# EAGLE design ZORRO-LAN-IDE-CP-V2 (EAGLE 6.6.0)

## Sheet 1 of 3
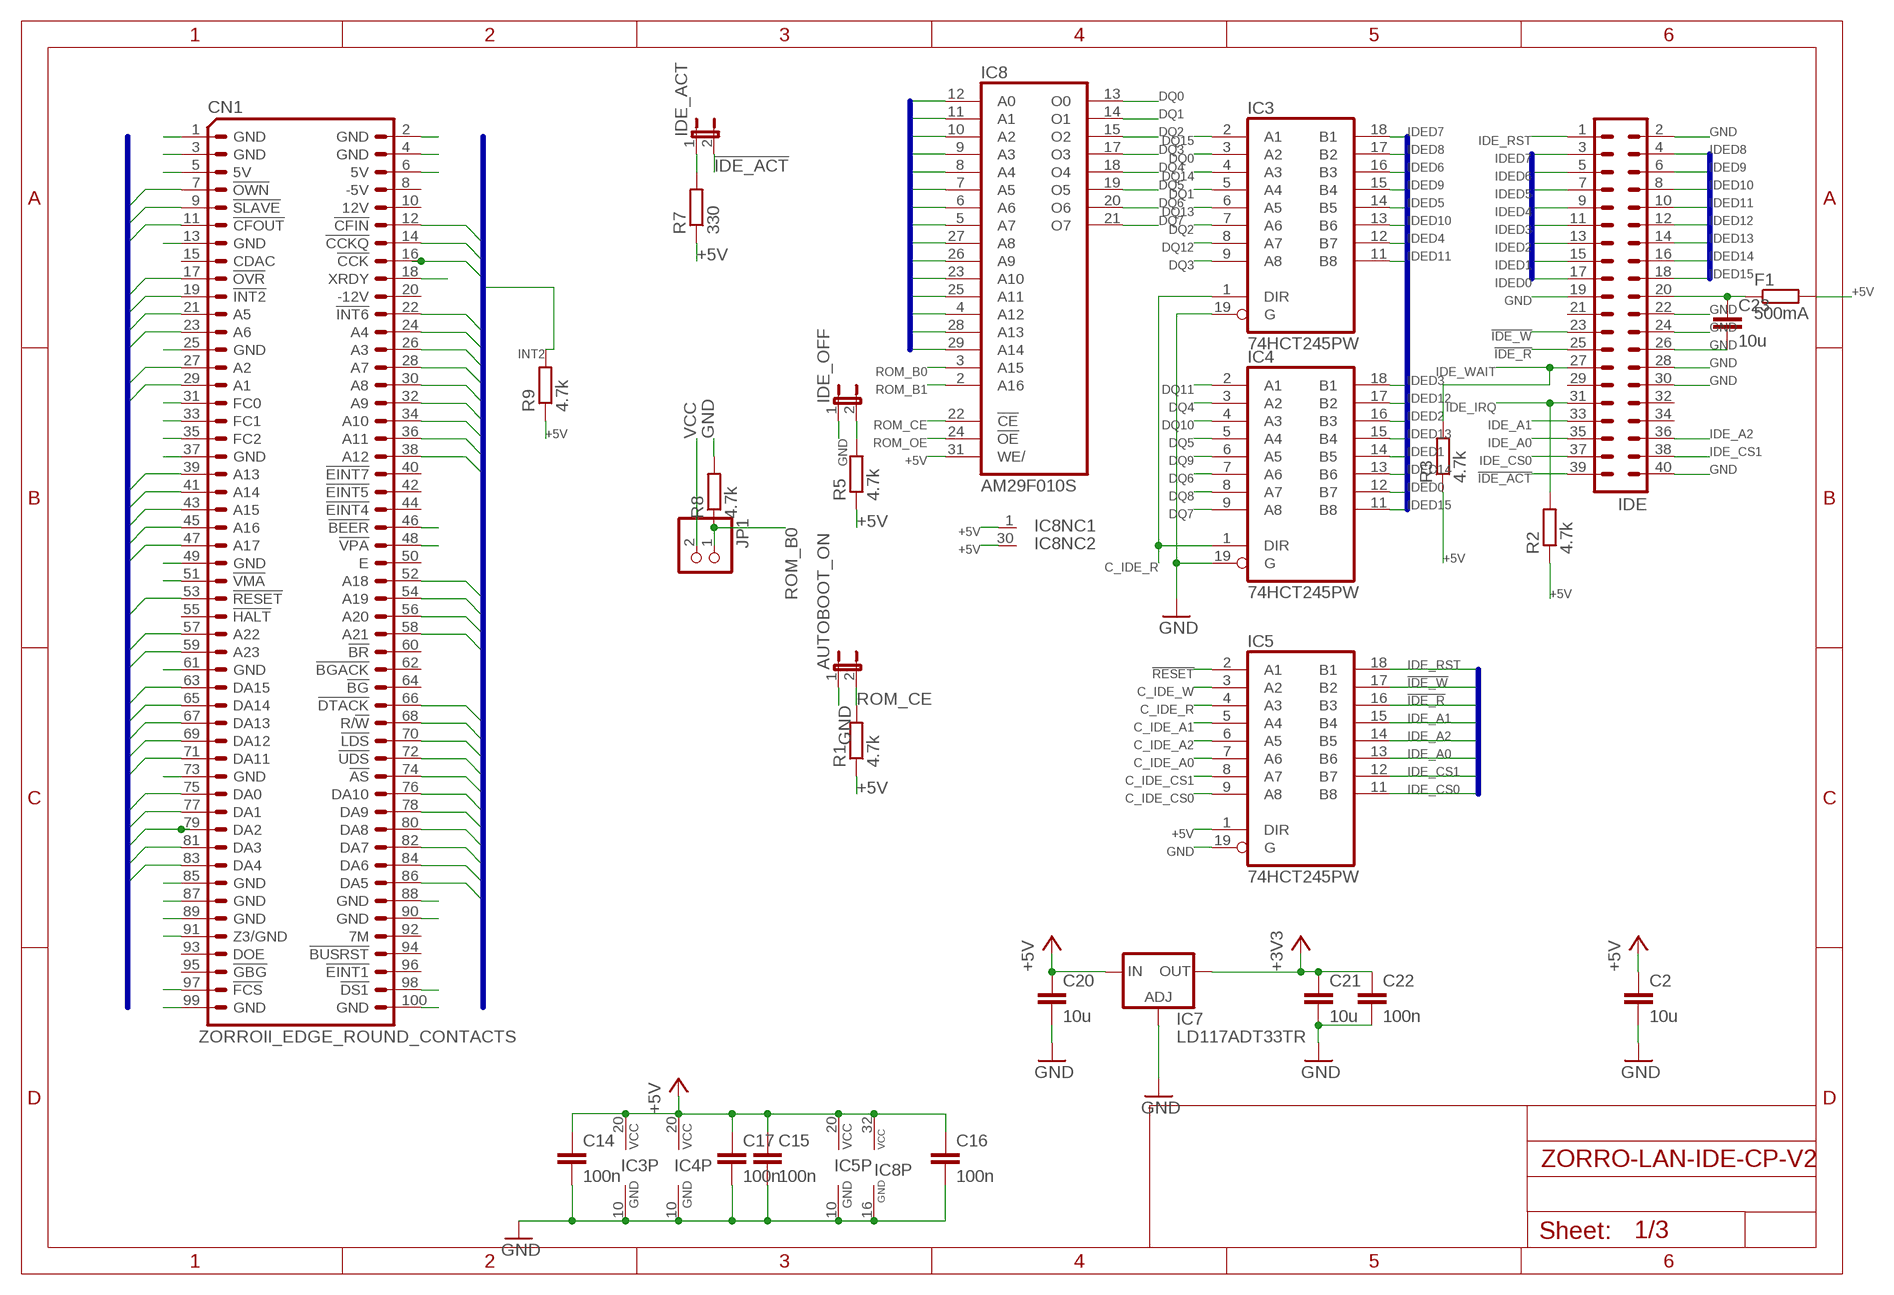
[diagram p0: schematic, sheet 1]

### Parts
AUTOBOOT_ON  JP1E  [JP1]
C2  10u  C-EUC0805K  [C0805K]
C14  100n  C-EUC0603K  [C0603K]
C15  100n  C-EUC0603K  [C0603K]
C16  100n  C-EUC0603K  [C0603K]
C17  100n  C-EUC0603K  [C0603K]
C20  10u  C-EUC1210K  [C1210K]
C21  10u  C-EUC1210K  [C1210K]
C22  100n  C-EUC0603K  [C0603K]
C23  10u  C-EUC0805K  [C0805K]
CN1  ZORROII_EDGE_ROUND_CONTACTS  [LKONT_50_R]
F1  500mA  R-EU_R2512  [R2512]
IC3  74HCT245PW  [TSSOP20]
IC4  74HCT245PW  [TSSOP20]
IC5  74HCT245PW  [TSSOP20]
IC7  LD117ADT33TR  [DPACK]
IC8  AM29F010S  [PLCC-SR32]
IDE  ML40  [ML40]
IDE_ACT  JP1E  [JP1]
IDE_OFF  JP1E  [JP1]
JP1  PINHD-1X02_2.54-S  [1X02-S]
R1  4.7k  R-EU_R0603  [R0603]
R2  4.7k  R-EU_R0603  [R0603]
R3  4.7k  R-EU_R0603  [R0603]
R5  4.7k  R-EU_R0603  [R0603]
R7  330  R-EU_R0603  [R0603]
R8  4.7k  R-EU_R0603  [R0603]
R9  4.7k  R-EU_R0603  [R0603]

### Nets
!AS: CN1.74(!AS!) ; also sheet 2
!BERR: CN1.46(!BEER!) ; also sheet 2
!CFIN: CN1.12(!CFIN!) ; also sheet 2
!CFOUT: CN1.11(!CFOUT!) ; also sheet 2
!DS0: CN1.51(!VMA!) ; also sheet 2
!DS1: CN1.98(!DS1!) ; also sheet 2
!DTACK: CN1.66(!DTACK!) ; also sheet 2
!FCS: CN1.97(!FCS!) ; also sheet 2
!IDE_ACT: IDE.39 IDE_ACT.2
!IDE_R: IC5.16(B3) IDE.25
!IDE_W: IC5.17(B2) IDE.23
!LDS: CN1.70(!LDS!) ; also sheet 2
!MTACK: CN1.48(!VPA!) ; also sheet 2
!MTCR: CN1.18(XRDY) ; also sheet 2
!OVR: CN1.17(!OVR!) ; also sheet 2
!OWN: CN1.7(!OWN!) ; also sheet 2
!RESET: CN1.53(!RESET!) IC5.2(A1) ; also sheet 2
!SLAVE: CN1.9(!SLAVE!) ; also sheet 2
!UDS: CN1.72(!UDS!) ; also sheet 2
+3V3: C21.1 C22.1 IC7.4(OUT) ; also sheet 2,3
+5V: C2.1 C14.1 C15.1 C16.1 C17.1 C20.1 CN1.5(5V) CN1.6(5V) F1.2 IC3.20(VCC) IC4.20(VCC) IC5.1(DIR) IC5.20(VCC) IC7.3(IN) IC8.1(NC) IC8.30(NC) IC8.31(WE/) IC8.32(VCC) R1.1 R2.1 R3.1 R5.1 R7.1 R9.1 ; also sheet 2,3
A1: CN1.29(A1) IC8.12(A0) ; also sheet 2
A2: CN1.27(A2) IC8.11(A1) ; also sheet 2
A3: CN1.26(A3) IC8.10(A2) ; also sheet 2
A4: CN1.24(A4) IC8.9(A3) ; also sheet 2
A5: CN1.21(A5) IC8.8(A4) ; also sheet 2
A6: CN1.23(A6) IC8.7(A5) ; also sheet 2
A7: CN1.28(A7) IC8.6(A6) ; also sheet 2
A8: CN1.30(A8) IC8.5(A7) ; also sheet 2
A9: CN1.32(A9) IC8.27(A8) ; also sheet 2
A10: CN1.34(A10) IC8.26(A9) ; also sheet 2
A11: CN1.36(A11) IC8.23(A10) ; also sheet 2
A12: CN1.38(A12) IC8.25(A11) ; also sheet 2
A13: CN1.39(A13) IC8.4(A12) ; also sheet 2
A14: CN1.41(A14) IC8.28(A13) ; also sheet 2
A15: CN1.43(A15) IC8.29(A14) ; also sheet 2
A16: CN1.45(A16) ; also sheet 2
A17: CN1.47(A17) ; also sheet 2
A18: CN1.52(A18) ; also sheet 2
A19: CN1.54(A19) ; also sheet 2
A20: CN1.56(A20) ; also sheet 2
A21: CN1.58(A21) ; also sheet 2
A22: CN1.57(A22) ; also sheet 2
A23: CN1.59(A23) ; also sheet 2
AUTO_BOOT_OFF: IDE_OFF.2 R5.2 ; also sheet 2
C1: CN1.14(!CCKQ!) ; also sheet 2
C3: CN1.16(!CCK!) ; also sheet 2
C_IDE_A0: IC5.7(A6) ; also sheet 2
C_IDE_A1: IC5.5(A4) ; also sheet 2
C_IDE_A2: IC5.6(A5) ; also sheet 2
C_IDE_CS0: IC5.9(A8) ; also sheet 2
C_IDE_CS1: IC5.8(A7) ; also sheet 2
C_IDE_R: IC3.1(DIR) IC4.1(DIR) IC5.4(A3) ; also sheet 2
C_IDE_W: IC5.3(A2) ; also sheet 2
D0: CN1.75(DA0) ; also sheet 2
D1: CN1.77(DA1) ; also sheet 2
D2: CN1.79(DA2) ; also sheet 2
D3: CN1.81(DA3) ; also sheet 2
D4: CN1.83(DA4) ; also sheet 2
D5: CN1.86(DA5) ; also sheet 2
D6: CN1.84(DA6) ; also sheet 2
D7: CN1.82(DA7) ; also sheet 2
D8: CN1.80(DA8) ; also sheet 2
D9: CN1.78(DA9) ; also sheet 2
D10: CN1.76(DA10) ; also sheet 2
D11: CN1.71(DA11) ; also sheet 2
D12: CN1.69(DA12) ; also sheet 2
D13: CN1.67(DA13) ; also sheet 2
D14: CN1.65(DA14) ; also sheet 2
D15: CN1.63(DA15) ; also sheet 2
DQ0: IC3.3(A2) IC8.13(O0) ; also sheet 2,3
DQ1: IC3.5(A4) IC8.14(O1) ; also sheet 2,3
DQ2: IC3.7(A6) IC8.15(O2) ; also sheet 2,3
DQ3: IC3.9(A8) IC8.17(O3) ; also sheet 2,3
DQ4: IC4.3(A2) IC8.18(O4) ; also sheet 2,3
DQ5: IC4.5(A4) IC8.19(O5) ; also sheet 2,3
DQ6: IC4.7(A6) IC8.20(O6) ; also sheet 2,3
DQ7: IC4.9(A8) IC8.21(O7) ; also sheet 2,3
DQ8: IC4.8(A7) ; also sheet 2,3
DQ9: IC4.6(A5) ; also sheet 2,3
DQ10: IC4.4(A3) ; also sheet 2,3
DQ11: IC4.2(A1) ; also sheet 2,3
DQ12: IC3.8(A7) ; also sheet 2,3
DQ13: IC3.6(A5) ; also sheet 2,3
DQ14: IC3.4(A3) ; also sheet 2,3
DQ15: IC3.2(A1) ; also sheet 2,3
FC0: CN1.31(FC0)
FC1: CN1.33(FC1)
FC2: CN1.35(FC2)
GND: AUTOBOOT_ON.1 C2.2 C14.2 C15.2 C16.2 C17.2 C20.2 C21.2 C22.2 C23.2 CN1.1(GND) CN1.2(GND) CN1.3(GND) CN1.4(GND) CN1.13(GND) CN1.25(GND) CN1.37(GND) CN1.49(GND) CN1.61(GND) CN1.73(GND) CN1.85(GND) CN1.87(GND) CN1.88(GND) CN1.89(GND) CN1.90(GND) CN1.99(GND) CN1.100(GND) IC3.10(GND) IC3.19(G) IC4.10(GND) IC4.19(G) IC5.10(GND) IC5.19(G) IC7.1(ADJ) IC8.16(GND) IDE.2 IDE.19 IDE.22 IDE.24 IDE.26 IDE.28 IDE.30 IDE.40 IDE_OFF.1 R8.2 ; also sheet 2,3
IDE_A0: IC5.13(B6) IDE.35
IDE_A1: IC5.15(B4) IDE.33
IDE_A2: IC5.14(B5) IDE.36
IDE_CS0: IC5.11(B8) IDE.37
IDE_CS1: IC5.12(B7) IDE.38
IDE_IRQ: IDE.31 R2.2
IDE_RST: IC5.18(B1) IDE.1 ; also sheet 3
IDE_WAIT: IDE.27 R3.2 ; also sheet 2
IDED0: IC4.12(B7) IDE.17
IDED1: IC4.14(B5) IDE.15
IDED2: IC4.16(B3) IDE.13
IDED3: IC4.18(B1) IDE.11
IDED4: IC3.12(B7) IDE.9
IDED5: IC3.14(B5) IDE.7
IDED6: IC3.16(B3) IDE.5
IDED7: IC3.18(B1) IDE.3
IDED8: IC3.17(B2) IDE.4
IDED9: IC3.15(B4) IDE.6
IDED10: IC3.13(B6) IDE.8
IDED11: IC3.11(B8) IDE.10
IDED12: IC4.17(B2) IDE.12
IDED13: IC4.15(B4) IDE.14
IDED14: IC4.13(B6) IDE.16
IDED15: IC4.11(B8) IDE.18
INT2: CN1.19(!INT2!) R9.2 ; also sheet 2
INT6: CN1.22(!INT6!)
KEY_PIN_POWER: C23.1 F1.1 IDE.20
N$42: IDE_ACT.1 R7.2
R/W: CN1.68(R/!W!) ; also sheet 2
ROM_B0: IC8.3(A15) JP1.1 R8.1 ; also sheet 2
ROM_B1: IC8.2(A16) ; also sheet 2
ROM_CE: AUTOBOOT_ON.2 IC8.22(!CE) R1.2
ROM_OE: IC8.24(!OE) ; also sheet 2
VCC: JP1.2
Z3: CN1.91(Z3/GND) ; also sheet 2
Unconnected: CN1.8(-5V) CN1.10(12V) CN1.15(CDAC) CN1.20(-12V) CN1.40(!EINT7!) CN1.42(!EINT5!) CN1.44(!EINT4!) CN1.50(E) CN1.55(!HALT!) CN1.60(!BR!) CN1.62(!BGACK!) CN1.64(!BG!) CN1.92(7M) CN1.93(DOE) CN1.94(!BUSRST!) CN1.95(!GBG!) CN1.96(!EINT1!) IDE.21 IDE.29 IDE.32 IDE.34

### Buses
IDED[0..15]
IDE_RST,IDE_A[0..2],IDE_CS[0..1],!IDE_R,!IDE_W
A[1..23]
A[1..31],D[0..15],C1,C3,!UDS,!LDS,!RESET,!AS,!DTACK,R/W,!OWN,!SLAVE,!CFIN,!CFOUT,!OVR,INT2,INT6
A[1..23],D[0..15],C1,C3,!UDS,!LDS,!RESET,!AS,!DTACK,R/W,!OWN,!SLAVE,!CFIN,!CFOUT,!OVR,INT2,INT6

## Sheet 2 of 3
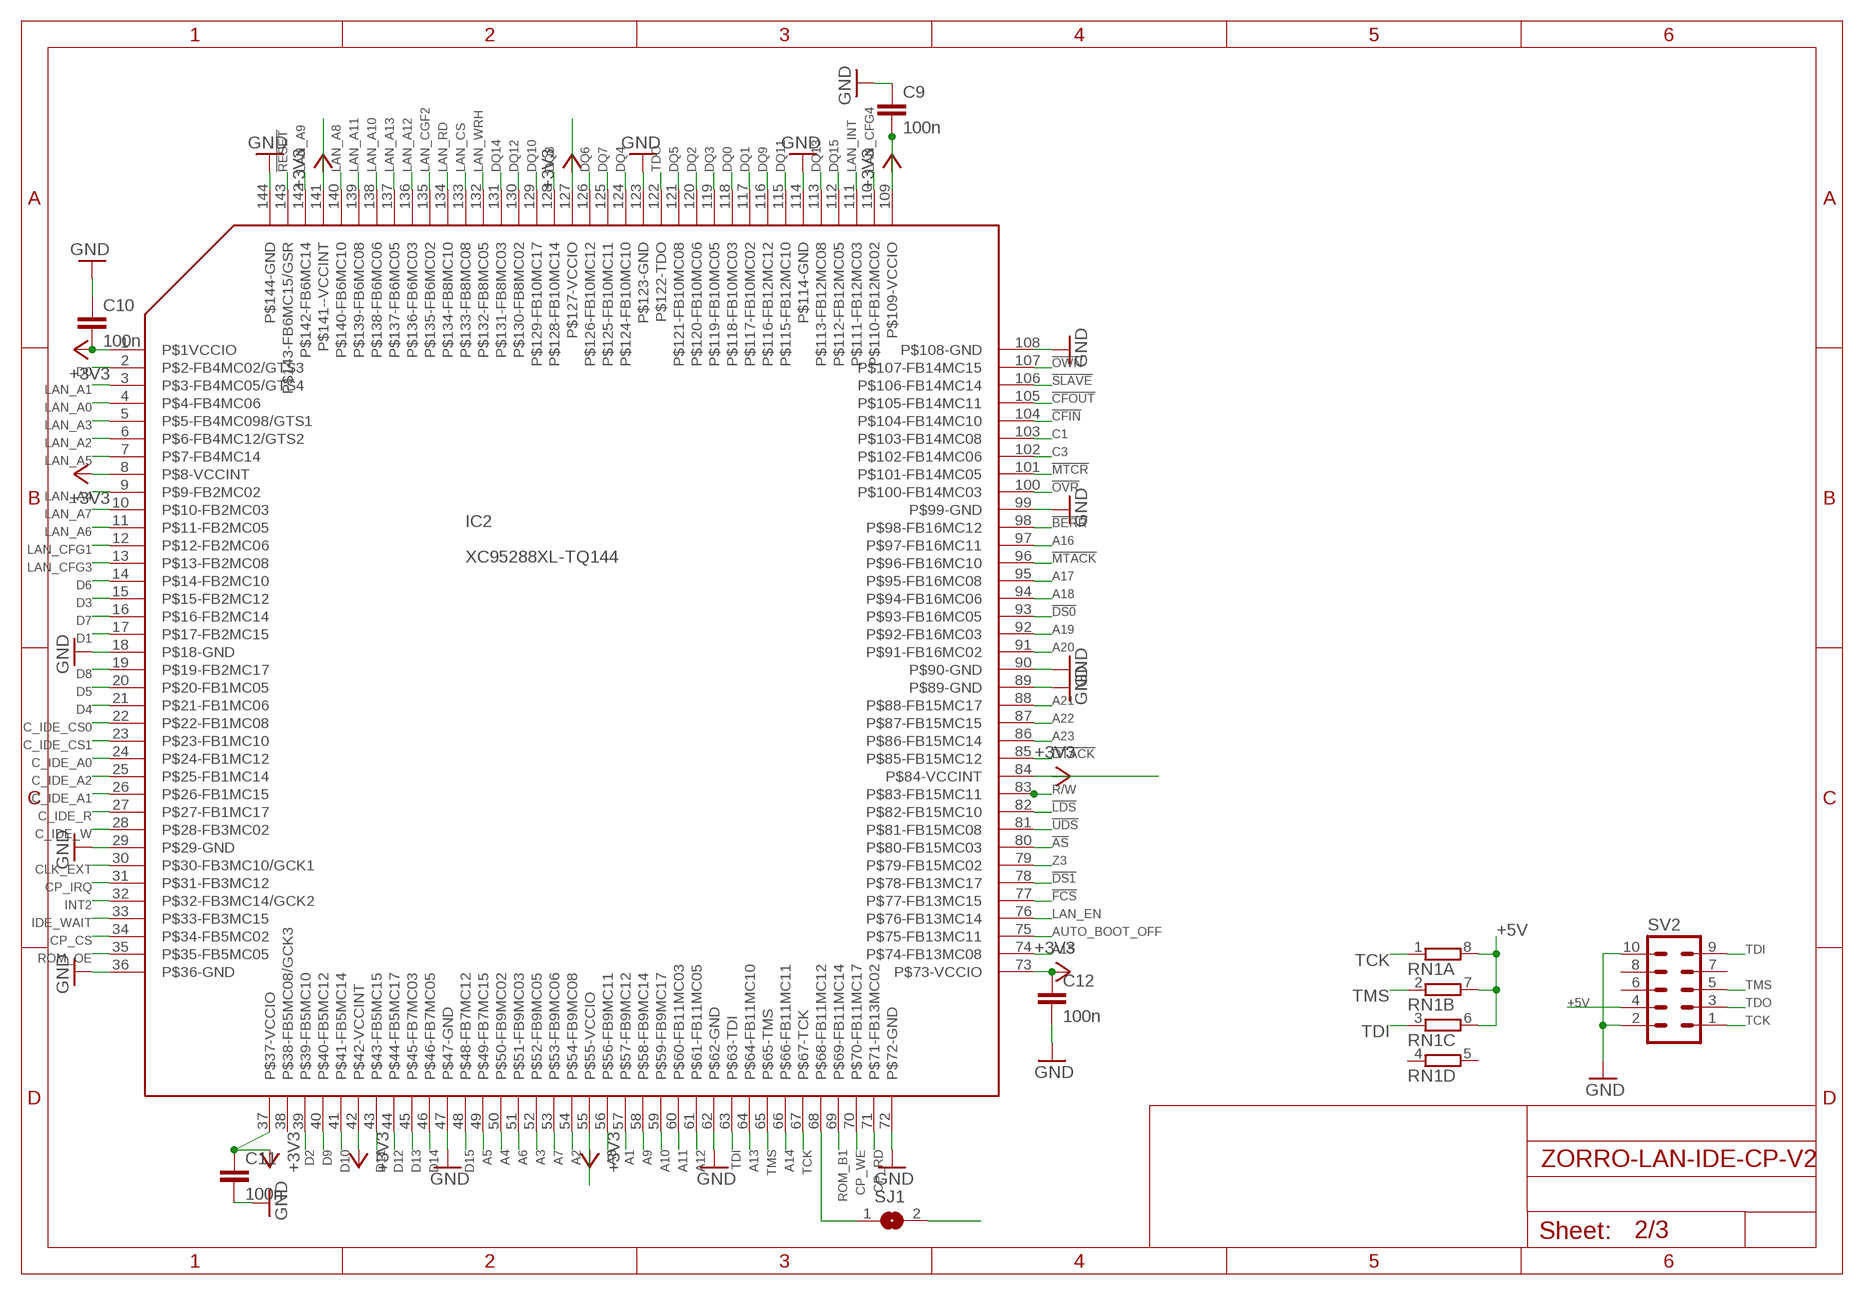
[diagram p1: schematic, sheet 2]

### Parts
C9  100n  C-EUC0603K  [C0603K]
C10  100n  C-EUC0603K  [C0603K]
C11  100n  C-EUC0603K  [C0603K]
C12  100n  C-EUC0603K  [C0603K]
IC2  XC95288XL-TQ144  [TQFP144]
RN1  4R-NCAY16  [CAY16]
SJ1  SJ  [SJ]
SV2  ML10L  [ML10L]

### Nets
!AS: IC2.80(P$80-FB15MC03) ; also sheet 1
!BERR: IC2.98(P$98-FB16MC12) ; also sheet 1
!CFIN: IC2.104(P$104-FB14MC10) ; also sheet 1
!CFOUT: IC2.105(P$105-FB14MC11) ; also sheet 1
!DS0: IC2.93(P$93-FB16MC05) ; also sheet 1
!DS1: IC2.78(P$78-FB13MC17) ; also sheet 1
!DTACK: IC2.85(P$85-FB15MC12) ; also sheet 1
!FCS: IC2.77(P$77-FB13MC15) ; also sheet 1
!LDS: IC2.82(P$82-FB15MC10) ; also sheet 1
!MTACK: IC2.96(P$96-FB16MC10) ; also sheet 1
!MTCR: IC2.101(P$101-FB14MC05) ; also sheet 1
!OVR: IC2.100(P$100-FB14MC03) ; also sheet 1
!OWN: IC2.107(P$107-FB14MC15) ; also sheet 1
!RESET: IC2.143(P$143-FB6MC15/GSR) ; also sheet 1
!SLAVE: IC2.106(P$106-FB14MC14) ; also sheet 1
!UDS: IC2.81(P$81-FB15MC08) ; also sheet 1
+3V3: C9.2 C10.2 C11.1 C12.1 IC2.1(P$1VCCIO) IC2.8(P$8-VCCINT) IC2.37(P$37-VCCIO) IC2.42(P$42-VCCINT) IC2.55(P$55-VCCIO) IC2.73(P$73-VCCIO) IC2.84(P$84-VCCINT) IC2.109(P$109-VCCIO) IC2.127(P$127-VCCIO) IC2.141(P$141--VCCINT) ; also sheet 1,3
+5V: RN1.6 RN1.7 RN1.8 SV2.4 ; also sheet 1,3
A1: IC2.57(P$57-FB9MC12) ; also sheet 1
A2: IC2.54(P$54-FB9MC08) ; also sheet 1
A3: IC2.52(P$52-FB9MC05) ; also sheet 1
A4: IC2.50(P$50-FB9MC02) ; also sheet 1
A5: IC2.49(P$49-FB7MC15) ; also sheet 1
A6: IC2.51(P$51-FB9MC03) ; also sheet 1
A7: IC2.53(P$53-FB9MC06) ; also sheet 1
A8: IC2.56(P$56-FB9MC11) ; also sheet 1
A9: IC2.58(P$58-FB9MC14) ; also sheet 1
A10: IC2.59(P$59-FB9MC17) ; also sheet 1
A11: IC2.60(P$60-FB11MC03) ; also sheet 1
A12: IC2.61(P$61-FB11MC05) ; also sheet 1
A13: IC2.64(P$64-FB11MC10) ; also sheet 1
A14: IC2.66(P$66-FB11MC11) ; also sheet 1
A15: IC2.74(P$74-FB13MC08) ; also sheet 1
A16: IC2.97(P$97-FB16MC11) ; also sheet 1
A17: IC2.95(P$95-FB16MC08) ; also sheet 1
A18: IC2.94(P$94-FB16MC06) ; also sheet 1
A19: IC2.92(P$92-FB16MC03) ; also sheet 1
A20: IC2.91(P$91-FB16MC02) ; also sheet 1
A21: IC2.88(P$88-FB15MC17) ; also sheet 1
A22: IC2.87(P$87-FB15MC15) ; also sheet 1
A23: IC2.86(P$86-FB15MC14) ; also sheet 1
AUTO_BOOT_OFF: IC2.75(P$75-FB13MC11) ; also sheet 1
C1: IC2.103(P$103-FB14MC08) ; also sheet 1
C3: IC2.102(P$102-FB14MC06) ; also sheet 1
C_IDE_A0: IC2.24(P$24-FB1MC12) ; also sheet 1
C_IDE_A1: IC2.26(P$26-FB1MC15) ; also sheet 1
C_IDE_A2: IC2.25(P$25-FB1MC14) ; also sheet 1
C_IDE_CS0: IC2.22(P$22-FB1MC08) ; also sheet 1
C_IDE_CS1: IC2.23(P$23-FB1MC10) ; also sheet 1
C_IDE_R: IC2.27(P$27-FB1MC17) ; also sheet 1
C_IDE_W: IC2.28(P$28-FB3MC02) ; also sheet 1
CLK_EXT: IC2.30(P$30-FB3MC10/GCK1) ; also sheet 3
CP_CS: IC2.34(P$34-FB5MC02) ; also sheet 3
CP_IRQ: IC2.31(P$31-FB3MC12) ; also sheet 3
CP_RD: IC2.71(P$71-FB13MC02) ; also sheet 3
CP_WE: IC2.70(P$70-FB11MC17) ; also sheet 3
D0: IC2.2(P$2-FB4MC02/GTS3) ; also sheet 1
D1: IC2.17(P$17-FB2MC15) ; also sheet 1
D2: IC2.39(P$39-FB5MC10) ; also sheet 1
D3: IC2.15(P$15-FB2MC12) ; also sheet 1
D4: IC2.21(P$21-FB1MC06) ; also sheet 1
D5: IC2.20(P$20-FB1MC05) ; also sheet 1
D6: IC2.14(P$14-FB2MC10) ; also sheet 1
D7: IC2.16(P$16-FB2MC14) ; also sheet 1
D8: IC2.19(P$19-FB2MC17) ; also sheet 1
D9: IC2.40(P$40-FB5MC12) ; also sheet 1
D10: IC2.41(P$41-FB5MC14) ; also sheet 1
D11: IC2.43(P$43-FB5MC15) ; also sheet 1
D12: IC2.44(P$44-FB5MC17) ; also sheet 1
D13: IC2.45(P$45-FB7MC03) ; also sheet 1
D14: IC2.46(P$46-FB7MC05) ; also sheet 1
D15: IC2.48(P$48-FB7MC12) ; also sheet 1
DQ0: IC2.118(P$118-FB10MC03) ; also sheet 1,3
DQ1: IC2.117(P$117-FB10MC02) ; also sheet 1,3
DQ2: IC2.120(P$120-FB10MC06) ; also sheet 1,3
DQ3: IC2.119(P$119-FB10MC05) ; also sheet 1,3
DQ4: IC2.124(P$124-FB10MC10) ; also sheet 1,3
DQ5: IC2.121(P$121-FB10MC08) ; also sheet 1,3
DQ6: IC2.126(P$126-FB10MC12) ; also sheet 1,3
DQ7: IC2.125(P$125-FB10MC11) ; also sheet 1,3
DQ8: IC2.128(P$128-FB10MC14) ; also sheet 1,3
DQ9: IC2.116(P$116-FB12MC12) ; also sheet 1,3
DQ10: IC2.129(P$129-FB10MC17) ; also sheet 1,3
DQ11: IC2.115(P$115-FB12MC10) ; also sheet 1,3
DQ12: IC2.130(P$130-FB8MC02) ; also sheet 1,3
DQ13: IC2.113(P$113-FB12MC08) ; also sheet 1,3
DQ14: IC2.131(P$131-FB8MC03) ; also sheet 1,3
DQ15: IC2.112(P$112-FB12MC05) ; also sheet 1,3
GND: C9.1 C10.1 C11.2 C12.2 IC2.18(P$18-GND) IC2.29(P$29-GND) IC2.36(P$36-GND) IC2.47(P$47-GND) IC2.62(P$62-GND) IC2.72(P$72-GND) IC2.89(P$89-GND) IC2.90(P$90-GND) IC2.99(P$99-GND) IC2.108(P$108-GND) IC2.114(P$114-GND) IC2.123(P$123-GND) IC2.144(P$144-GND) SV2.2 SV2.10 ; also sheet 1,3
IDE_WAIT: IC2.33(P$33-FB3MC15) ; also sheet 1
INT2: IC2.32(P$32-FB3MC14/GCK2) ; also sheet 1
LAN_A0: IC2.4(P$4-FB4MC06) ; also sheet 3
LAN_A1: IC2.3(P$3-FB4MC05/GTS4) ; also sheet 3
LAN_A2: IC2.6(P$6-FB4MC12/GTS2) ; also sheet 3
LAN_A3: IC2.5(P$5-FB4MC098/GTS1) ; also sheet 3
LAN_A4: IC2.9(P$9-FB2MC02) ; also sheet 3
LAN_A5: IC2.7(P$7-FB4MC14) ; also sheet 3
LAN_A6: IC2.11(P$11-FB2MC05) ; also sheet 3
LAN_A7: IC2.10(P$10-FB2MC03) ; also sheet 3
LAN_A8: IC2.140(P$140-FB6MC10) ; also sheet 3
LAN_A9: IC2.142(P$142-FB6MC14) ; also sheet 3
LAN_A10: IC2.138(P$138-FB6MC06) ; also sheet 3
LAN_A11: IC2.139(P$139-FB6MC08) ; also sheet 3
LAN_A12: IC2.136(P$136-FB6MC03) ; also sheet 3
LAN_A13: IC2.137(P$137-FB6MC05) ; also sheet 3
LAN_CFG1: IC2.12(P$12-FB2MC06) ; also sheet 3
LAN_CFG3: IC2.13(P$13-FB2MC08) ; also sheet 3
LAN_CFG4: IC2.110(P$110-FB12MC02) ; also sheet 3
LAN_CGF2: IC2.135(P$135-FB6MC02) ; also sheet 3
LAN_CS: IC2.133(P$133-FB8MC08) ; also sheet 3
LAN_EN: IC2.76(P$76-FB13MC14) ; also sheet 3
LAN_INT: IC2.111(P$111-FB12MC03) ; also sheet 3
LAN_RD: IC2.134(P$134-FB8MC10) ; also sheet 3
LAN_WRH: IC2.132(P$132-FB8MC05) ; also sheet 3
N$40: IC2.68(P$68-FB11MC12) SJ1.1
R/W: IC2.83(P$83-FB15MC11) ; also sheet 1
ROM_B0: SJ1.2 ; also sheet 1
ROM_B1: IC2.69(P$69-FB11MC14) ; also sheet 1
ROM_OE: IC2.35(P$35-FB5MC05) ; also sheet 1
TCK: IC2.67(P$67-TCK) RN1.1 SV2.1
TDI: IC2.63(P$63-TDI) RN1.3 SV2.9
TDO: IC2.122(P$122-TDO) SV2.3
TMS: IC2.65(P$65-TMS) RN1.2 SV2.5
Z3: IC2.79(P$79-FB15MC02) ; also sheet 1
Unconnected: IC2.38(P$38-FB5MC08/GCK3) RN1.4 RN1.5 SV2.6 SV2.7 SV2.8

## Sheet 3 of 3
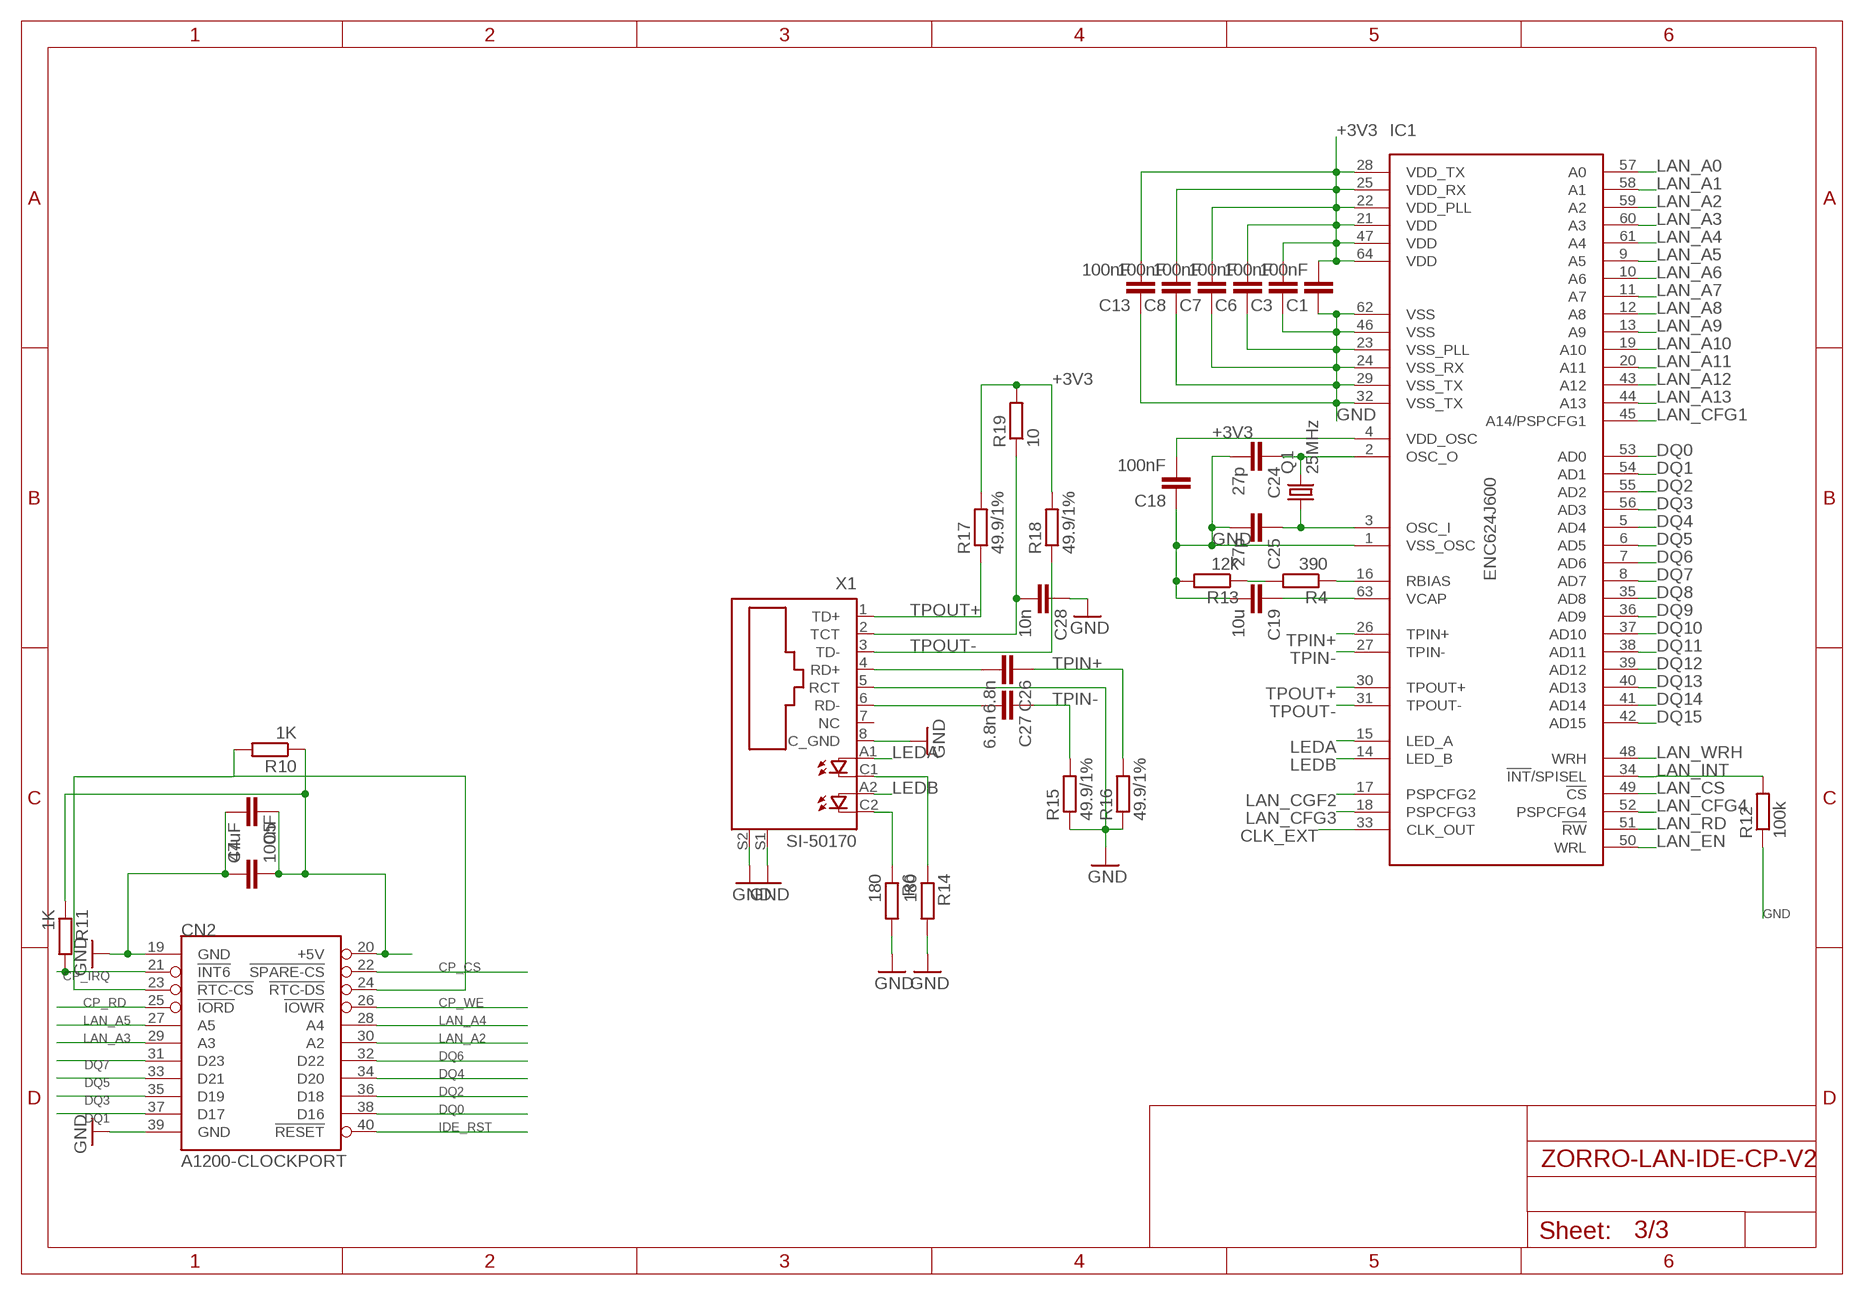
[diagram p2: schematic, sheet 3]

### Parts
C1  100nF  C-EUC0805K  [C0805K]
C3  100nF  C-EUC0805K  [C0805K]
C4  100nF  C-EUC0805K  [C0805K]
C5  47uF  C-EUC1206K  [C1206K]
C6  100nF  C-EUC0805K  [C0805K]
C7  100nF  C-EUC0805K  [C0805K]
C8  100nF  C-EUC0805K  [C0805K]
C13  100nF  C-EUC0805K  [C0805K]
C18  100nF  C-EUC0805K  [C0805K]
C19  10u  C-EUC1206K  [C1206K]
C24  27p  C-EUC0805K  [C0805K]
C25  27p  C-EUC0805K  [C0805K]
C26  6.8n  C-EUC0805K  [C0805K]
C27  6.8n  C-EUC0805K  [C0805K]
C28  10n  C-EUC0805K  [C0805K]
CN2  A1200-CLOCKPORT  [CP-2X11-2.00]
IC1  ENC624J600  [SQFP-S-10X10-64]
Q1  25MHz  CRYSTALHC18U-V  [HC18U-V]
R4  390  R-EU_R0603  [R0603]
R6  180  R-EU_R0603  [R0603]
R10  1K  R-EU_R0805  [R0805]
R11  1K  R-EU_R0805  [R0805]
R12  100k  R-EU_R0603  [R0603]
R13  12k  R-EU_R0603  [R0603]
R14  180  R-EU_R0603  [R0603]
R15  49.9/1%  R-EU_R0603  [R0603]
R16  49.9/1%  R-EU_R0603  [R0603]
R17  49.9/1%  R-EU_R0603  [R0603]
R18  49.9/1%  R-EU_R0603  [R0603]
R19  10  R-EU_R0603  [R0603]
X1  SI-50170  [SI-50170]

### Nets
+3V3: C1.2 C3.2 C6.2 C7.2 C8.2 C13.2 C18.2 IC1.4(VDD_OSC) IC1.21(VDD) IC1.22(VDD_PLL) IC1.25(VDD_RX) IC1.28(VDD_TX) IC1.47(VDD) IC1.64(VDD) R17.2 R18.2 R19.2 ; also sheet 1,2
+5V: C4.2 C5.1 CN2.20(+5V) R10.1 R11.1 ; also sheet 1,2
CLK_EXT: IC1.33(CLK_OUT) ; also sheet 2
CP_CS: CN2.22(!SPARE-CS) ; also sheet 2
CP_IRQ: CN2.21(!INT6) R11.2 ; also sheet 2
CP_RD: CN2.25(!IORD) ; also sheet 2
CP_WE: CN2.26(!IOWR) ; also sheet 2
DQ0: CN2.38(D16) IC1.53(AD0) ; also sheet 1,2
DQ1: CN2.37(D17) IC1.54(AD1) ; also sheet 1,2
DQ2: CN2.36(D18) IC1.55(AD2) ; also sheet 1,2
DQ3: CN2.35(D19) IC1.56(AD3) ; also sheet 1,2
DQ4: CN2.34(D20) IC1.5(AD4) ; also sheet 1,2
DQ5: CN2.33(D21) IC1.6(AD5) ; also sheet 1,2
DQ6: CN2.32(D22) IC1.7(AD6) ; also sheet 1,2
DQ7: CN2.31(D23) IC1.8(AD7) ; also sheet 1,2
DQ8: IC1.35(AD8) ; also sheet 1,2
DQ9: IC1.36(AD9) ; also sheet 1,2
DQ10: IC1.37(AD10) ; also sheet 1,2
DQ11: IC1.38(AD11) ; also sheet 1,2
DQ12: IC1.39(AD12) ; also sheet 1,2
DQ13: IC1.40(AD13) ; also sheet 1,2
DQ14: IC1.41(AD14) ; also sheet 1,2
DQ15: IC1.42(AD15) ; also sheet 1,2
GND: C1.1 C3.1 C4.1 C5.2 C6.1 C7.1 C8.1 C13.1 C18.1 C19.2 C24.2 C25.2 C28.1 CN2.19(GND) CN2.39(GND) IC1.1(VSS_OSC) IC1.23(VSS_PLL) IC1.24(VSS_RX) IC1.29(VSS_TX) IC1.32(VSS_TX) IC1.46(VSS) IC1.62(VSS) R6.2 R12.1 R13.2 R14.2 R15.1 R16.1 X1.5(RCT) X1.8(C_GND) X1.S1 X1.S2 ; also sheet 1,2
IDE_RST: CN2.40(!RESET) ; also sheet 1
LAN_A0: IC1.57(A0) ; also sheet 2
LAN_A1: IC1.58(A1) ; also sheet 2
LAN_A2: CN2.30(A2) IC1.59(A2) ; also sheet 2
LAN_A3: CN2.29(A3) IC1.60(A3) ; also sheet 2
LAN_A4: CN2.28(A4) IC1.61(A4) ; also sheet 2
LAN_A5: CN2.27(A5) IC1.9(A5) ; also sheet 2
LAN_A6: IC1.10(A6) ; also sheet 2
LAN_A7: IC1.11(A7) ; also sheet 2
LAN_A8: IC1.12(A8) ; also sheet 2
LAN_A9: IC1.13(A9) ; also sheet 2
LAN_A10: IC1.19(A10) ; also sheet 2
LAN_A11: IC1.20(A11) ; also sheet 2
LAN_A12: IC1.43(A12) ; also sheet 2
LAN_A13: IC1.44(A13) ; also sheet 2
LAN_CFG1: IC1.45(A14/PSPCFG1) ; also sheet 2
LAN_CFG3: IC1.18(PSPCFG3) ; also sheet 2
LAN_CFG4: IC1.52(PSPCFG4) ; also sheet 2
LAN_CGF2: IC1.17(PSPCFG2) ; also sheet 2
LAN_CS: IC1.49(!CS) ; also sheet 2
LAN_EN: IC1.50(WRL) ; also sheet 2
LAN_INT: IC1.34(!INT!/SPISEL) R12.2 ; also sheet 2
LAN_RD: IC1.51(!RW) ; also sheet 2
LAN_WRH: IC1.48(WRH) ; also sheet 2
LEDA: IC1.15(LED_A) X1.A1(A)
LEDB: IC1.14(LED_B) X1.A2(A1)
N$1: C28.2 R19.1 X1.2(TCT)
N$3: CN2.23(!RTC-CS) CN2.24(!RTC-DS) R10.2
N$4: C19.1 IC1.63(VCAP)
N$5: R4.2 R13.1
N$6: IC1.16(RBIAS) R4.1
N$7: C26.2 X1.4(RD+)
N$8: C25.1 IC1.3(OSC_I) Q1.1
N$9: C24.1 IC1.2(OSC_O) Q1.2
N$10: C27.2 X1.6(RD-)
N$11: R14.1 X1.C1(C)
N$12: R6.1 X1.C2(C1)
TPIN+: C26.1 IC1.26(TPIN+) R16.2
TPIN-: C27.1 IC1.27(TPIN-) R15.2
TPOUT+: IC1.30(TPOUT+) R17.1 X1.1(TD+)
TPOUT-: IC1.31(TPOUT-) R18.1 X1.3(TD-)
Unconnected: X1.7(NC)

## Library data of the parts
AUTOBOOT_ON IDE_ACT IDE_OFF = jumper:JP1E: JUMPER
C1-C28 = rcl:C-EU: CAPACITOR, European symbol
CN1 = Amiga:ZORROII
CN2 = Amiga:A1200-CLOCKPORT
F1 R1-R19 = rcl:R-EU_: RESISTOR, European symbol
IC1 = OLIMEX-ENJ:ENC624J600
IC2 = xilinx_xc9572xl-tq100:XC95288XL-TQ144
IC3-IC5 = 74xx-eu:74*245: Octal BUS TRANSCEIVER, 3-state
IC7 = v-reg:LD117A?*: Low drop fixed and adjustable positive voltage regulators 1 A Source: http://www.st.com/stonline/products/literature/ds/7194/ld1117axx.pdf
IC8 = am29-memory:AM29F010S: 1-Megabit FLASH MEMORY (128 K x 8 bit) 5 V-only
IDE = con-harting-ml:ML40: HARTING; OC_FARNELL: unknown; OC_NEWARK: unknown
JP1 = pinhead-2:PINHD-1X02: PIN HEADER
Q1 = crystal:CRYSTAL: CRYSTAL; OC_FARNELL: unknown; OC_NEWARK: unknown
RN1 = resistor-dil:4R-N: Array Chip Resistor Source: RS Component / Phycomp; OC_FARNELL: unknown; OC_NEWARK: unknown
SJ1 = jumper:SJ: SMD solder JUMPER
SV2 = con-harting-ml:ML10: HARTING; OC_FARNELL: unknown; OC_NEWARK: unknown
X1 = con-stewart:SI-50170: Ethernet Connector MagJack (R) Source: www.stewartconnector.com .. si-50170.pdf; OC_FARNELL: unknown; OC_NEWARK: unknown

## Net classes
0 default: width 0.152 mm, drill 0.3 mm
1 Power: width 0.305 mm, drill 0.3 mm, clearance 0.102 mm

## Board
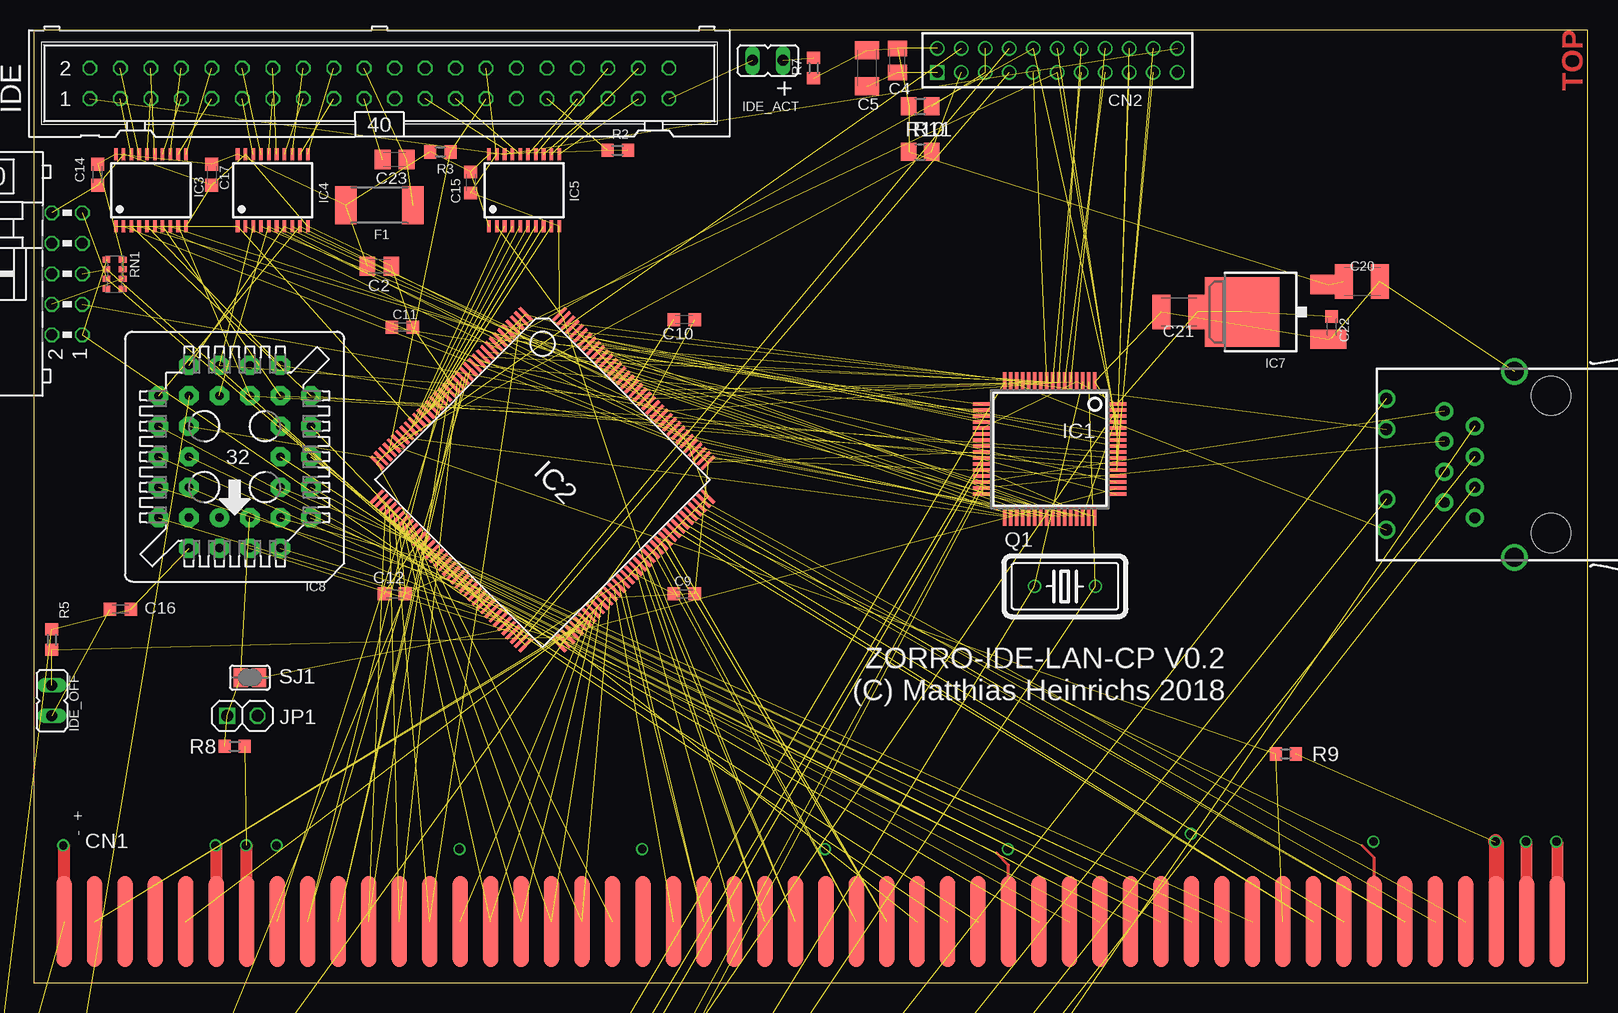
[diagram p3: board, top side]
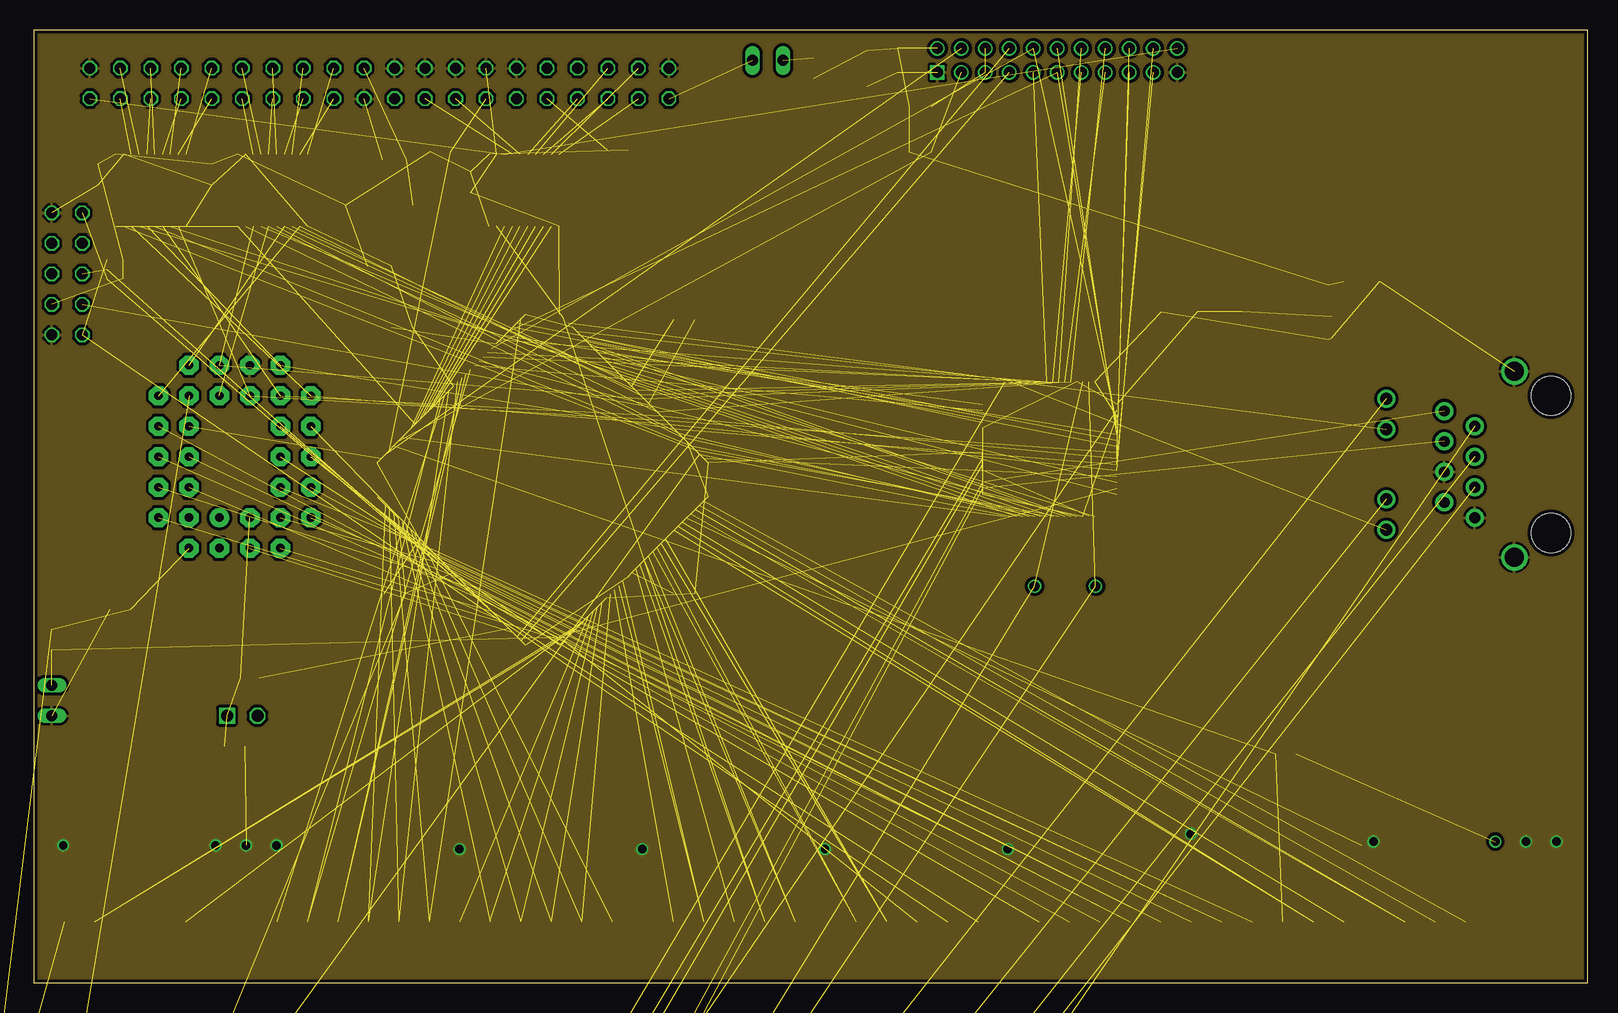
[diagram p4: board, inner layer Route2]
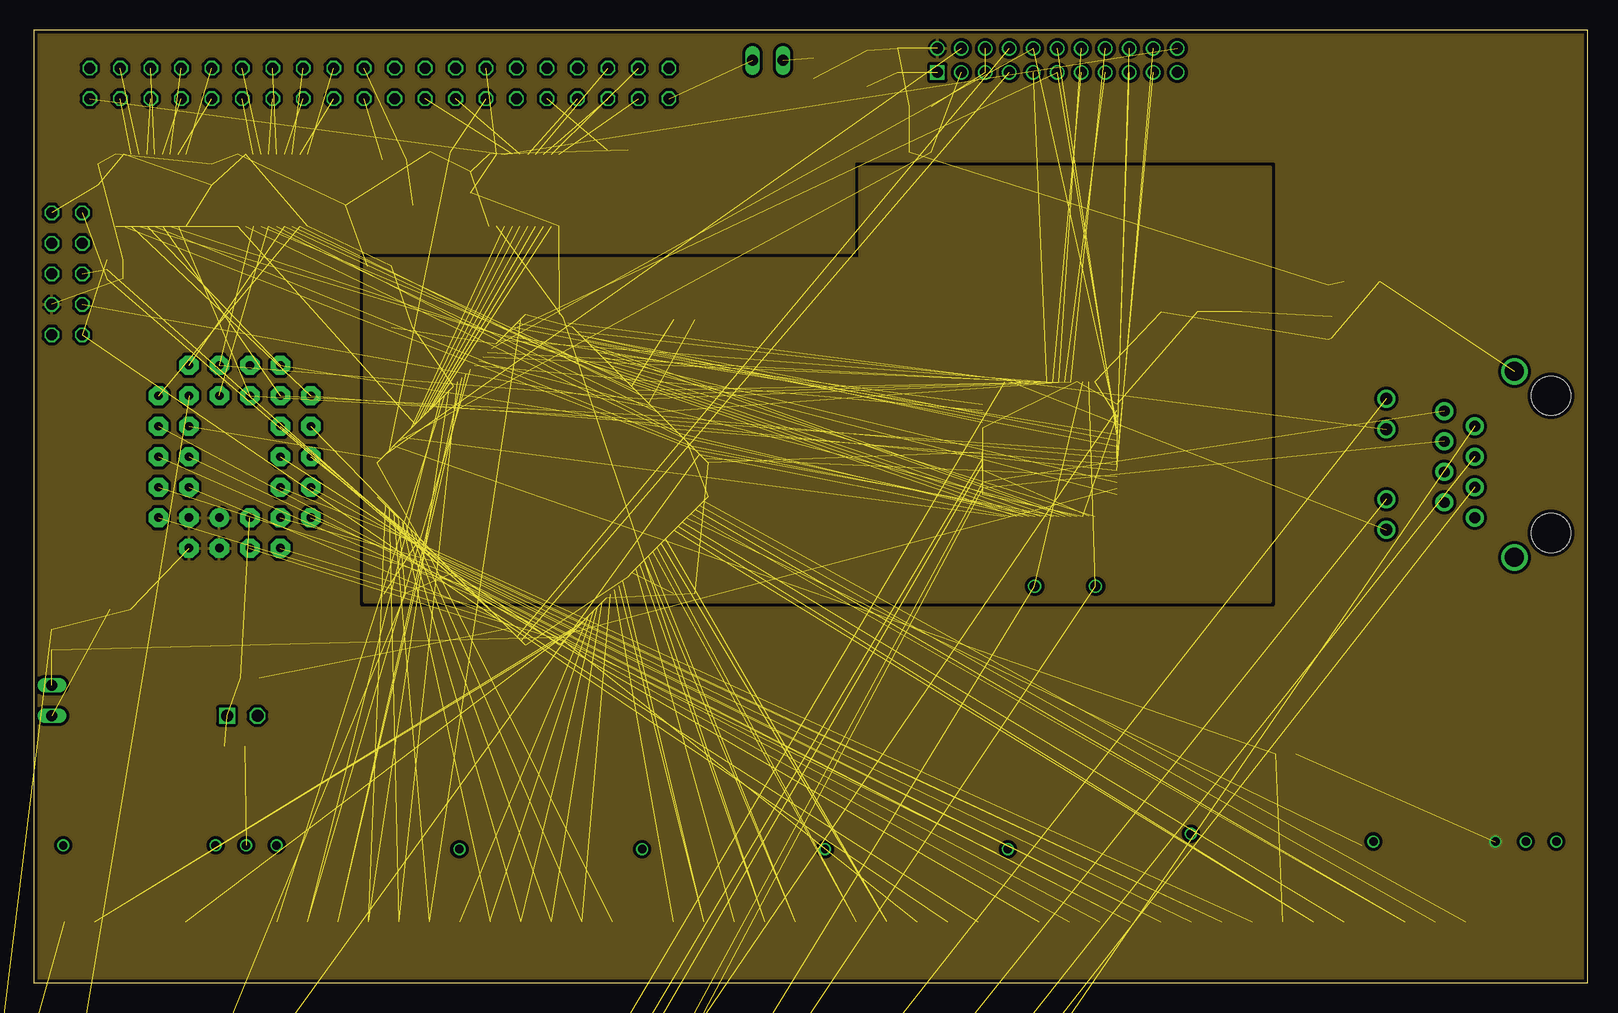
[diagram p5: board, inner layer Route15]
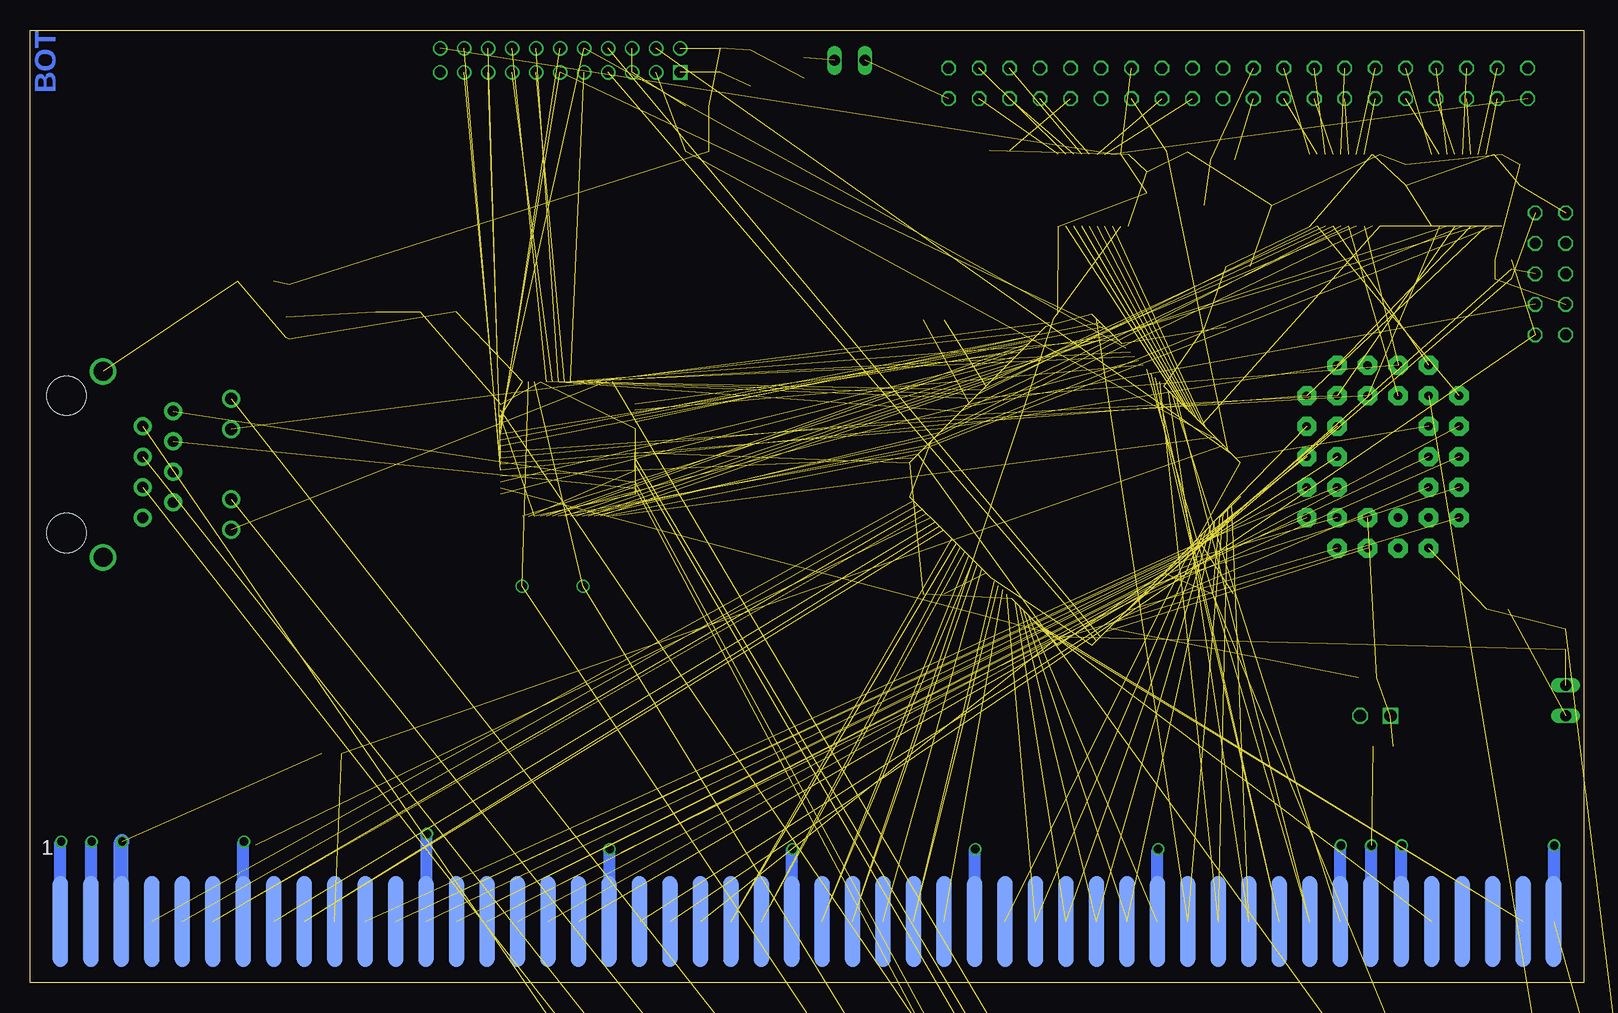
[diagram p6: board, bottom side, seen from below]

Size 129.54 x 79.36 mm. Coordinates in mm from the lower left corner, seen from the top.
Outline: 129.54,0 129.54,79.36 0,79.36 0,0 129.54,0
Copper layers (1+2*15+16): Top 0.035mm / dielectric 0.36mm / Route2 0.035mm / dielectric 0.71mm / Route15 0.035mm / dielectric 0.36mm / Bottom 0.035mm
Design rules "LeitOn - Standard-Eagle-DRU - 4-Lagen Multilayer - deutsch - Rev 2.0 *": minimum track width 0.15mm, minimum drill 0.3mm, track to track 0.15mm, track to pad 0.15mm, pad to pad 0.15mm, via to via 0.15mm, smd to smd 0.15mm, copper to edge 0.3mm, drill to drill 0.3mm, minimum pad ring 0.15mm, minimum via ring 0.15mm, stop-mask expansion 0.075mm, vias tented up to drill 0mil, thermal gap 0.2mm

### Footprints (pad centres in the part's own frame; a part is rotated, then mirrored left to right if it is on the bottom)
JP1 = drill 0.914 long: 1 0,-1.27; 2 0,1.27
C0805K = smd 1.3 x 1.6: 1 -1,0; 2 1,0
C1206K = smd 1.5 x 2: 1 -1.5,0; 2 1.5,0
C0603K = smd 1.05 x 1.08: 1 -0.875,0; 2 0.875,0
C1210K = smd 1.5 x 2.9: 1 -1.5,0; 2 1.5,0
LKONT_50_R = smd 1.27 x 7.62 bottom: 1 64.77,0; 3 62.23,0; 5 59.69,0; 7 57.15,0; 9 54.61,0; 11 52.07,0; 13 49.53,0; 15 46.99,0; 17 44.45,0; 19 41.91,0; 21 39.37,0; 23 36.83,0; 25 34.29,0; 27 31.75,0; 29 29.21,0; 31 26.67,0; 33 24.13,0; 35 21.59,0; 37 19.05,0; 39 16.51,0; 41 13.97,0; 43 11.43,0; 45 8.89,0; 47 6.35,0; 49 3.81,0; 51 1.27,0; 53 -1.27,0; 55 -3.81,0; 57 -6.35,0; 59 -8.89,0; 61 -11.43,0; 63 -13.97,0; 65 -16.51,0; 67 -19.05,0; 69 -21.59,0; 71 -24.13,0; 73 -26.67,0; 75 -29.21,0; 77 -31.75,0; 79 -34.29,0; 81 -36.83,0; 83 -39.37,0; 85 -41.91,0; 87 -44.45,0; 89 -46.99,0; 91 -49.53,0; 93 -52.07,0; 95 -54.61,0; 97 -57.15,0; 99 -59.69,0 | smd 1.27 x 7.62: 2 64.77,0; 4 62.23,0; 6 59.69,0; 8 57.15,0; 10 54.61,0; 12 52.07,0; 14 49.53,0; 16 46.99,0; 18 44.45,0; 20 41.91,0; 22 39.37,0; 24 36.83,0; 26 34.29,0; 28 31.75,0; 30 29.21,0; 32 26.67,0; 34 24.13,0; 36 21.59,0; 38 19.05,0; 40 16.51,0; 42 13.97,0; 44 11.43,0; 46 8.89,0; 48 6.35,0; 50 3.81,0; 52 1.27,0; 54 -1.27,0; 56 -3.81,0; 58 -6.35,0; 60 -8.89,0; 62 -11.43,0; 64 -13.97,0; 66 -16.51,0; 68 -19.05,0; 70 -21.59,0; 72 -24.13,0; 74 -26.67,0; 76 -29.21,0; 78 -31.75,0; 80 -34.29,0; 82 -36.83,0; 84 -39.37,0; 86 -41.91,0; 88 -44.45,0; 90 -46.99,0; 92 -49.53,0; 94 -52.07,0; 96 -54.61,0; 98 -57.15,0; 100 -59.69,0
CP-2X11-2.00 = drill 0.914 square: 19 -10,-1 | drill 0.914: 20 -10,1; 21 -8,-1; 22 -8,1; 23 -6,-1; 24 -6,1; 25 -4,-1; 26 -4,1; 27 -2,-1; 28 -2,1; 29 0,-1; 30 0,1; 31 2,-1; 32 2,1; 33 4,-1; 34 4,1; 35 6,-1; 36 6,1; 37 8,-1; 38 8,1; 39 10,-1; 40 10,1
R2512 = smd 1.8 x 3.2: 1 -2.8,0; 2 2.8,0
SQFP-S-10X10-64 = smd 0.3 x 1.6: 1 -3.75,-5.6; 2 -3.25,-5.6; 3 -2.75,-5.6; 4 -2.25,-5.6; 5 -1.75,-5.6; 6 -1.25,-5.6; 7 -0.75,-5.6; 8 -0.25,-5.6; 9 0.25,-5.6; 10 0.75,-5.6; 11 1.25,-5.6; 12 1.75,-5.6; 13 2.25,-5.6; 14 2.75,-5.6; 15 3.25,-5.6; 16 3.75,-5.6; 33 3.75,5.6; 34 3.25,5.6; 35 2.75,5.6; 36 2.25,5.6; 37 1.75,5.6; 38 1.25,5.6; 39 0.75,5.6; 40 0.25,5.6; 41 -0.25,5.6; 42 -0.75,5.6; 43 -1.25,5.6; 44 -1.75,5.6; 45 -2.25,5.6; 46 -2.75,5.6; 47 -3.25,5.6; 48 -3.75,5.6 | smd 1.6 x 0.3: 17 5.6,-3.75; 18 5.6,-3.25; 19 5.6,-2.75; 20 5.6,-2.25; 21 5.6,-1.75; 22 5.6,-1.25; 23 5.6,-0.75; 24 5.6,-0.25; 25 5.6,0.25; 26 5.6,0.75; 27 5.6,1.25; 28 5.6,1.75; 29 5.6,2.25; 30 5.6,2.75; 31 5.6,3.25; 32 5.6,3.75; 49 -5.6,3.75; 50 -5.6,3.25; 51 -5.6,2.75; 52 -5.6,2.25; 53 -5.6,1.75; 54 -5.6,1.25; 55 -5.6,0.75; 56 -5.6,0.25; 57 -5.6,-0.25; 58 -5.6,-0.75; 59 -5.6,-1.25; 60 -5.6,-1.75; 61 -5.6,-2.25; 62 -5.6,-2.75; 63 -5.6,-3.25; 64 -5.6,-3.75
TQFP144 = smd 0.27 x 1.5: 1 -8.75,-10.75; 2 -8.25,-10.75; 3 -7.75,-10.75; 4 -7.25,-10.75; 5 -6.75,-10.75; 6 -6.25,-10.75; 7 -5.75,-10.75; 8 -5.25,-10.75; 9 -4.75,-10.75; 10 -4.25,-10.75; 11 -3.75,-10.75; 12 -3.25,-10.75; 13 -2.75,-10.75; 14 -2.25,-10.75; 15 -1.75,-10.75; 16 -1.25,-10.75; 17 -0.75,-10.75; 18 -0.25,-10.75; 19 0.25,-10.75; 20 0.75,-10.75; 21 1.25,-10.75; 22 1.75,-10.75; 23 2.25,-10.75; 24 2.75,-10.75; 25 3.25,-10.75; 26 3.75,-10.75; 27 4.25,-10.75; 28 4.75,-10.75; 29 5.25,-10.75; 30 5.75,-10.75; 31 6.25,-10.75; 32 6.75,-10.75; 33 7.25,-10.75; 34 7.75,-10.75; 35 8.25,-10.75; 36 8.75,-10.75; 73 8.75,10.75; 74 8.25,10.75; 75 7.75,10.75; 76 7.25,10.75; 77 6.75,10.75; 78 6.25,10.75; 79 5.75,10.75; 80 5.25,10.75; 81 4.75,10.75; 82 4.25,10.75; 83 3.75,10.75; 84 3.25,10.75; 85 2.75,10.75; 86 2.25,10.75; 87 1.75,10.75; 88 1.25,10.75; 89 0.75,10.75; 90 0.25,10.75; 91 -0.25,10.75; 92 -0.75,10.75; 93 -1.25,10.75; 94 -1.75,10.75; 95 -2.25,10.75; 96 -2.75,10.75; 97 -3.25,10.75; 98 -3.75,10.75; 99 -4.25,10.75; 100 -4.75,10.75; 101 -5.25,10.75; 102 -5.75,10.75; 103 -6.25,10.75; 104 -6.75,10.75; 105 -7.25,10.75; 106 -7.75,10.75; 107 -8.25,10.75; 108 -8.75,10.75 | smd 1.5 x 0.27: 37 10.75,-8.75; 38 10.75,-8.25; 39 10.75,-7.75; 40 10.75,-7.25; 41 10.75,-6.75; 42 10.75,-6.25; 43 10.75,-5.75; 44 10.75,-5.25; 45 10.75,-4.75; 46 10.75,-4.25; 47 10.75,-3.75; 48 10.75,-3.25; 49 10.75,-2.75; 50 10.75,-2.25; 51 10.75,-1.75; 52 10.75,-1.25; 53 10.75,-0.75; 54 10.75,-0.25; 55 10.75,0.25; 56 10.75,0.75; 57 10.75,1.25; 58 10.75,1.75; 59 10.75,2.25; 60 10.75,2.75; 61 10.75,3.25; 62 10.75,3.75; 63 10.75,4.25; 64 10.75,4.75; 65 10.75,5.25; 66 10.75,5.75; 67 10.75,6.25; 68 10.75,6.75; 69 10.75,7.25; 70 10.75,7.75; 71 10.75,8.25; 72 10.75,8.75; 109 -10.75,8.75; 110 -10.75,8.25; 111 -10.75,7.75; 112 -10.75,7.25; 113 -10.75,6.75; 114 -10.75,6.25; 115 -10.75,5.75; 116 -10.75,5.25; 117 -10.75,4.75; 118 -10.75,4.25; 119 -10.75,3.75; 120 -10.75,3.25; 121 -10.75,2.75; 122 -10.75,2.25; 123 -10.75,1.75; 124 -10.75,1.25; 125 -10.75,0.75; 126 -10.75,0.25; 127 -10.75,-0.25; 128 -10.75,-0.75; 129 -10.75,-1.25; 130 -10.75,-1.75; 131 -10.75,-2.25; 132 -10.75,-2.75; 133 -10.75,-3.25; 134 -10.75,-3.75; 135 -10.75,-4.25; 136 -10.75,-4.75; 137 -10.75,-5.25; 138 -10.75,-5.75; 139 -10.75,-6.25; 140 -10.75,-6.75; 141 -10.75,-7.25; 142 -10.75,-7.75; 143 -10.75,-8.25; 144 -10.75,-8.75
TSSOP20 = smd 0.3 x 1: 1 -2.925,-3; 2 -2.275,-3; 3 -1.625,-3; 4 -0.975,-3; 5 -0.325,-3; 6 0.325,-3; 7 0.975,-3; 8 1.625,-3; 9 2.275,-3; 10 2.925,-3; 11 2.925,3; 12 2.275,3; 13 1.625,3; 14 0.975,3; 15 0.325,3; 16 -0.325,3; 17 -0.975,3; 18 -1.625,3; 19 -2.275,3; 20 -2.925,3
DPACK = smd 1.6 x 3: 1 -2.28,-4.8; 3 2.28,-4.8 | smd 5.8 x 6.2: 4 0,2.38
PLCC-SR32 = drill 0.7 pad 1.6: 1 1.27,5.08 | drill 0.7 pad 1.6 octagon: 2 -1.27,7.62; 3 -1.27,5.08; 4 -3.81,7.62; 5 -6.35,5.08; 6 -3.81,5.08; 7 -6.35,2.54; 8 -3.81,2.54; 9 -6.35,0; 10 -3.81,0; 11 -6.35,-2.54; 12 -3.81,-2.54; 13 -6.35,-5.08; 14 -3.81,-7.62; 15 -3.81,-5.08; 16 -1.27,-7.62; 17 -1.27,-5.08; 18 1.27,-7.62; 19 1.27,-5.08; 20 3.81,-7.62; 21 6.35,-5.08; 22 3.81,-5.08; 23 6.35,-2.54; 24 3.81,-2.54; 25 6.35,0; 26 3.81,0; 27 6.35,2.54; 28 3.81,2.54; 29 6.35,5.08; 30 3.81,7.62; 31 3.81,5.08; 32 1.27,7.62
ML40 = drill 0.914 octagon: 1 -24.13,-1.27; 2 -24.13,1.27; 3 -21.59,-1.27; 4 -21.59,1.27; 5 -19.05,-1.27; 6 -19.05,1.27; 7 -16.51,-1.27; 8 -16.51,1.27; 9 -13.97,-1.27; 10 -13.97,1.27; 11 -11.43,-1.27; 12 -11.43,1.27; 13 -8.89,-1.27; 14 -8.89,1.27; 15 -6.35,-1.27; 16 -6.35,1.27; 17 -3.81,-1.27; 18 -3.81,1.27; 19 -1.27,-1.27; 20 -1.27,1.27; 21 1.27,-1.27; 22 1.27,1.27; 23 3.81,-1.27; 24 3.81,1.27; 25 6.35,-1.27; 26 6.35,1.27; 27 8.89,-1.27; 28 8.89,1.27; 29 11.43,-1.27; 30 11.43,1.27; 31 13.97,-1.27; 32 13.97,1.27; 33 16.51,-1.27; 34 16.51,1.27; 35 19.05,-1.27; 36 19.05,1.27; 37 21.59,-1.27; 38 21.59,1.27; 39 24.13,-1.27; 40 24.13,1.27
1X02-S = drill 1.016 square: 1 -1.27,0 | drill 1.016 octagon: 2 1.27,0
HC18U-V = drill 0.813: 1 -2.54,0; 2 2.54,0
R0603 = smd 1 x 1.1: 1 -0.85,0; 2 0.85,0
R0805 = smd 1.3 x 1.5: 1 -0.95,0; 2 0.95,0
CAY16 = smd 0.5 x 0.65: 1 -1.2,-0.675; 2 -0.4,-0.675; 3 0.4,-0.675; 4 1.2,-0.675; 5 1.2,0.675; 6 0.4,0.675; 7 -0.4,0.675; 8 -1.2,0.675
SJ = smd 1.168 x 1.6: 1 -0.762,0; 2 0.762,0
ML10L = drill 0.914 octagon: 1 -5.08,-1.27; 2 -5.08,1.27; 3 -2.54,-1.27; 4 -2.54,1.27; 5 0,-1.27; 6 0,1.27; 7 2.54,-1.27; 8 2.54,1.27; 9 5.08,-1.27; 10 5.08,1.27
SI-50170 = drill 0.9 pad 1.5: 1 4.445,5.842; 2 3.175,3.302; 3 1.905,5.842; 4 0.635,3.302; 5 -0.635,5.842; 6 -1.905,3.302; 7 -3.175,5.842; 8 -4.445,3.302 | drill 1.016 pad 1.5: A1 -5.461,10.668; A2 2.921,10.668; C1 -2.921,10.668; C2 5.461,10.668 | drill 1.6 pad 2.2: S1 -7.747,0; S2 7.747,0 | hole 3.251: -5.715,-3.048; 5.715,-3.048

### Placement (x,y rotation side)
AUTOBOOT_ON  -16.89,-131.44 0 top  (outside the outline)
C1  -10.54,-66.04 0 top  (outside the outline)
C2  28.83,59.69 0 top
C3  -10.54,-71.12 0 top  (outside the outline)
C4  72.01,76.83 90 top
C5  69.47,76.2 270 top
C6  -10.54,-76.2 0 top  (outside the outline)
C7  -10.54,-81.28 0 top  (outside the outline)
C8  -10.54,-86.36 0 top  (outside the outline)
C9  54.23,32.38 0 top
C10  54.23,55.24 180 top
C11  30.73,54.61 0 top
C12  30.1,32.38 180 top
C13  -10.54,-91.44 0 top  (outside the outline)
C14  5.33,67.31 270 top
C15  36.45,66.67 270 top
C16  7.24,31.11 180 top
C17  14.86,67.31 270 top
C18  -10.54,-96.52 0 top  (outside the outline)
C19  -9.91,-101.6 0 top  (outside the outline)
C20  110.74,58.42 0 top
C21  95.5,55.88 180 top
C22  108.2,54.61 270 top
C23  30.1,68.58 180 top
C24  -10.54,-116.84 0 top  (outside the outline)
C25  -10.54,-121.92 0 top  (outside the outline)
C26  -36.58,-152.4 0 top  (outside the outline)
C27  -36.58,-157.48 0 top  (outside the outline)
C28  -36.58,-187.96 0 top  (outside the outline)
CN1  62.23,5.08 0 top
CN2  85.34,76.83 0 top
F1  28.83,64.77 180 top
IC1  84.71,44.45 180 top
IC2  42.43,41.91 225 top
IC3  9.78,66.04 0 top
IC4  19.94,66.04 0 top
IC5  40.89,66.04 0 top
IC7  103.12,55.88 90 top
IC8  16.76,43.81 180 top
IDE  28.83,74.93 0 top
IDE_ACT  61.21,76.83 90 top
IDE_OFF  1.52,23.5 0 top
JP1  17.4,22.23 0 top
Q1  85.98,33.02 0 top
R1  -18.16,-137.16 0 top  (outside the outline)
R2  48.69,69.34 180 top
R3  33.91,69.22 0 top
R4  -11.18,-106.68 0 top  (outside the outline)
R5  1.52,28.57 270 top
R6  -36.58,-142.24 0 top  (outside the outline)
R7  65.02,76.2 90 top
R8  16.76,19.68 0 top
R9  104.39,19.05 180 top
R10  73.91,73.03 0 top
R11  73.91,69.22 0 top
R12  -11.18,-46.99 0 top  (outside the outline)
R13  -11.18,-111.76 0 top  (outside the outline)
R14  -36.58,-147.32 0 top  (outside the outline)
R15  -36.58,-162.56 0 top  (outside the outline)
R16  -36.58,-167.64 0 top  (outside the outline)
R17  -36.58,-172.72 0 top  (outside the outline)
R18  -36.58,-177.8 0 top  (outside the outline)
R19  -36.58,-182.88 0 top  (outside the outline)
RN1  6.76,59.03 270 top
SJ1  18.03,25.4 180 top
SV2  2.79,59.05 90 top
X1  123.44,43.18 90 top

### Tracks (layer width: path | path; a pad name or v marks a point on that pad's centre or on a via)
!AS  (1 unrouted)
!BERR  (1 unrouted)
!CFIN  (1 unrouted)
!CFOUT  (1 unrouted)
!DS0  (1 unrouted)
!DS1  (1 unrouted)
!DTACK  (1 unrouted)
!FCS  (1 unrouted)
!IDE_ACT  (1 unrouted)
!IDE_R  (1 unrouted)
!IDE_W  (1 unrouted)
!LDS  (1 unrouted)
!MTACK  (1 unrouted)
!MTCR  (1 unrouted)
!OVR  (1 unrouted)
!OWN  (1 unrouted)
!RESET  (2 unrouted)
!SLAVE  (1 unrouted)
!UDS  (1 unrouted)
  Top 0.254: 38.05,5.13 CN1.72
+3V3  (33 unrouted)
  pour Route15 (isolate 0.254): 27.56,31.75 103.12,31.75 103.12,67.94 68.83,67.94 68.83,60.33 27.56,60.33
+5V  (via drill 0.7)  (25 unrouted)
  Top 1.27: v121.86,11.75 121.92,11.68 CN1.5
  Bottom 1.27: CN1.5 121.92,11.68 v121.86,11.75
  pour Route15 (isolate 0.254, rank 2): -0.38,89.53 129.79,89.53 129.79,-0.64 -0.38,-0.64
A1  (2 unrouted)
A2  (2 unrouted)
A3  (2 unrouted)
A4  (2 unrouted)
A5  (2 unrouted)
A6  (2 unrouted)
A7  (2 unrouted)
A8  (2 unrouted)
A9  (2 unrouted)
A10  (2 unrouted)
A11  (2 unrouted)
A12  (2 unrouted)
  Top 0.254: CN1.38 81.28,9.78 80.26,10.79
A13  (2 unrouted)
A14  (2 unrouted)
A15  (2 unrouted)
A16  (1 unrouted)
A17  (1 unrouted)
A18  (1 unrouted)
A19  (1 unrouted)
A20  (1 unrouted)
A21  (1 unrouted)
A22  (1 unrouted)
A23  (1 unrouted)
AUTO_BOOT_OFF  (2 unrouted)
C1  (1 unrouted)
  Top 0.254: CN1.14 111.76,10.41 110.74,11.43
C3  (1 unrouted)
C_IDE_A0  (1 unrouted)
C_IDE_A1  (1 unrouted)
C_IDE_A2  (1 unrouted)
C_IDE_CS0  (1 unrouted)
C_IDE_CS1  (1 unrouted)
C_IDE_R  (3 unrouted)
C_IDE_W  (1 unrouted)
CLK_EXT  (1 unrouted)
CP_CS  (1 unrouted)
CP_IRQ  (2 unrouted)
CP_RD  (1 unrouted)
CP_WE  (1 unrouted)
D0  (1 unrouted)
D1  (1 unrouted)
D2  (1 unrouted)
D3  (1 unrouted)
D4  (1 unrouted)
D5  (1 unrouted)
D6  (1 unrouted)
D7  (1 unrouted)
D8  (1 unrouted)
D9  (1 unrouted)
D10  (1 unrouted)
D11  (1 unrouted)
D12  (1 unrouted)
D13  (1 unrouted)
D14  (1 unrouted)
D15  (1 unrouted)
DQ0  (4 unrouted)
DQ1  (4 unrouted)
DQ2  (4 unrouted)
DQ3  (4 unrouted)
DQ4  (4 unrouted)
DQ5  (4 unrouted)
DQ6  (4 unrouted)
DQ7  (4 unrouted)
DQ8  (2 unrouted)
DQ9  (2 unrouted)
DQ10  (2 unrouted)
DQ11  (2 unrouted)
DQ12  (2 unrouted)
DQ13  (2 unrouted)
DQ14  (2 unrouted)
DQ15  (2 unrouted)
GND  (via drill 0.7)  (61 unrouted)
  Top 1.016: CN1.99 2.54,11.37 v2.48,11.43 | v15.18,11.43 15.24,11.37 CN1.89 | CN1.87 17.78,11.37 v17.72,11.43 | v126.94,11.75 127,11.68 CN1.1 | CN1.3 124.46,11.68 v124.4,11.75
  Bottom 1.016: v2.48,11.43 2.54,11.37 CN1.99 | CN1.89 15.24,11.37 v15.18,11.43 | v17.72,11.43 17.78,11.37 CN1.87 | CN1.85 20.32,11.37 v20.26,11.43 | CN1.73 35.56,11.05 v35.5,11.11 | v50.74,11.11 50.8,11.05 CN1.61 | CN1.49 66.04,11.05 v65.98,11.11 | v81.22,11.11 81.28,11.05 CN1.37 | CN1.1 127,11.68 v126.94,11.75 | v124.4,11.75 124.46,11.68 CN1.3 | CN1.13 111.76,11.68 v111.7,11.75 | v96.46,12.38 96.52,12.32 CN1.25
  pour Route2 (isolate 0.254): -0.38,0 129.79,0 129.79,90.17 -0.38,90.17
IDE_A0  (1 unrouted)
IDE_A1  (1 unrouted)
IDE_A2  (1 unrouted)
IDE_CS0  (1 unrouted)
IDE_CS1  (1 unrouted)
IDE_IRQ  (1 unrouted)
IDE_RST  (2 unrouted)
IDE_WAIT  (2 unrouted)
IDED0  (1 unrouted)
IDED1  (1 unrouted)
IDED2  (1 unrouted)
IDED3  (1 unrouted)
IDED4  (1 unrouted)
IDED5  (1 unrouted)
IDED6  (1 unrouted)
IDED7  (1 unrouted)
IDED8  (1 unrouted)
IDED9  (1 unrouted)
IDED10  (1 unrouted)
IDED11  (1 unrouted)
IDED12  (1 unrouted)
IDED13  (1 unrouted)
IDED14  (1 unrouted)
IDED15  (1 unrouted)
INT2  (2 unrouted)
KEY_PIN_POWER  (2 unrouted)
LAN_A0  (1 unrouted)
LAN_A1  (1 unrouted)
LAN_A2  (2 unrouted)
LAN_A3  (2 unrouted)
LAN_A4  (2 unrouted)
LAN_A5  (2 unrouted)
LAN_A6  (1 unrouted)
LAN_A7  (1 unrouted)
LAN_A8  (1 unrouted)
LAN_A9  (1 unrouted)
LAN_A10  (1 unrouted)
LAN_A11  (1 unrouted)
LAN_A12  (1 unrouted)
LAN_A13  (1 unrouted)
LAN_CFG1  (1 unrouted)
LAN_CFG3  (1 unrouted)
LAN_CFG4  (1 unrouted)
LAN_CGF2  (1 unrouted)
LAN_CS  (1 unrouted)
LAN_EN  (1 unrouted)
LAN_INT  (2 unrouted)
LAN_RD  (1 unrouted)
LAN_WRH  (1 unrouted)
LEDA  (1 unrouted)
LEDB  (1 unrouted)
N$1  (2 unrouted)
N$3  (2 unrouted)
N$4  (1 unrouted)
N$5  (1 unrouted)
N$6  (1 unrouted)
N$7  (1 unrouted)
N$8  (2 unrouted)
N$9  (2 unrouted)
N$10  (1 unrouted)
N$11  (1 unrouted)
N$12  (1 unrouted)
N$40  (1 unrouted)
N$42  (1 unrouted)
R/W  (1 unrouted)
ROM_B0  (3 unrouted)
ROM_B1  (1 unrouted)
ROM_CE  (2 unrouted)
ROM_OE  (1 unrouted)
TCK  (2 unrouted)
TDI  (2 unrouted)
TDO  (1 unrouted)
TMS  (2 unrouted)
TPIN+  (2 unrouted)
TPIN-  (2 unrouted)
TPOUT+  (2 unrouted)
TPOUT-  (2 unrouted)
Z3  (1 unrouted)

### Text on the board
Top: TOP
Bottom: BOT
tNames: + | ZORRO-IDE-LAN-CP V0.2 / (C) Matthias Heinrichs 2018 | - +